# EAGLE board PCB - alu40 - mupusb (EAGLE 9.6.2)
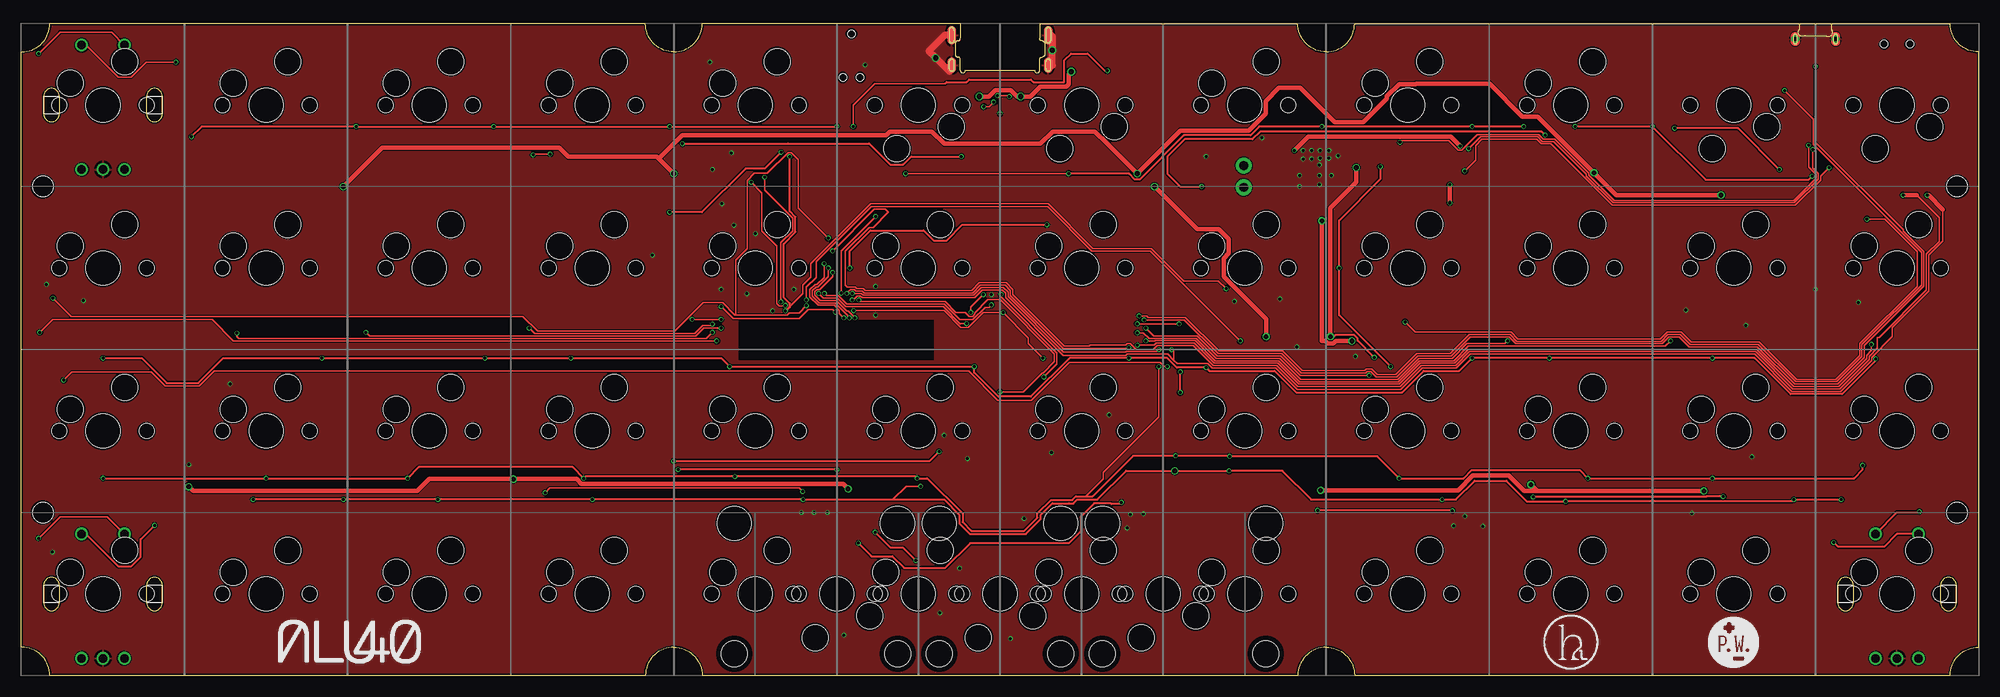
[diagram p2: board, top side]
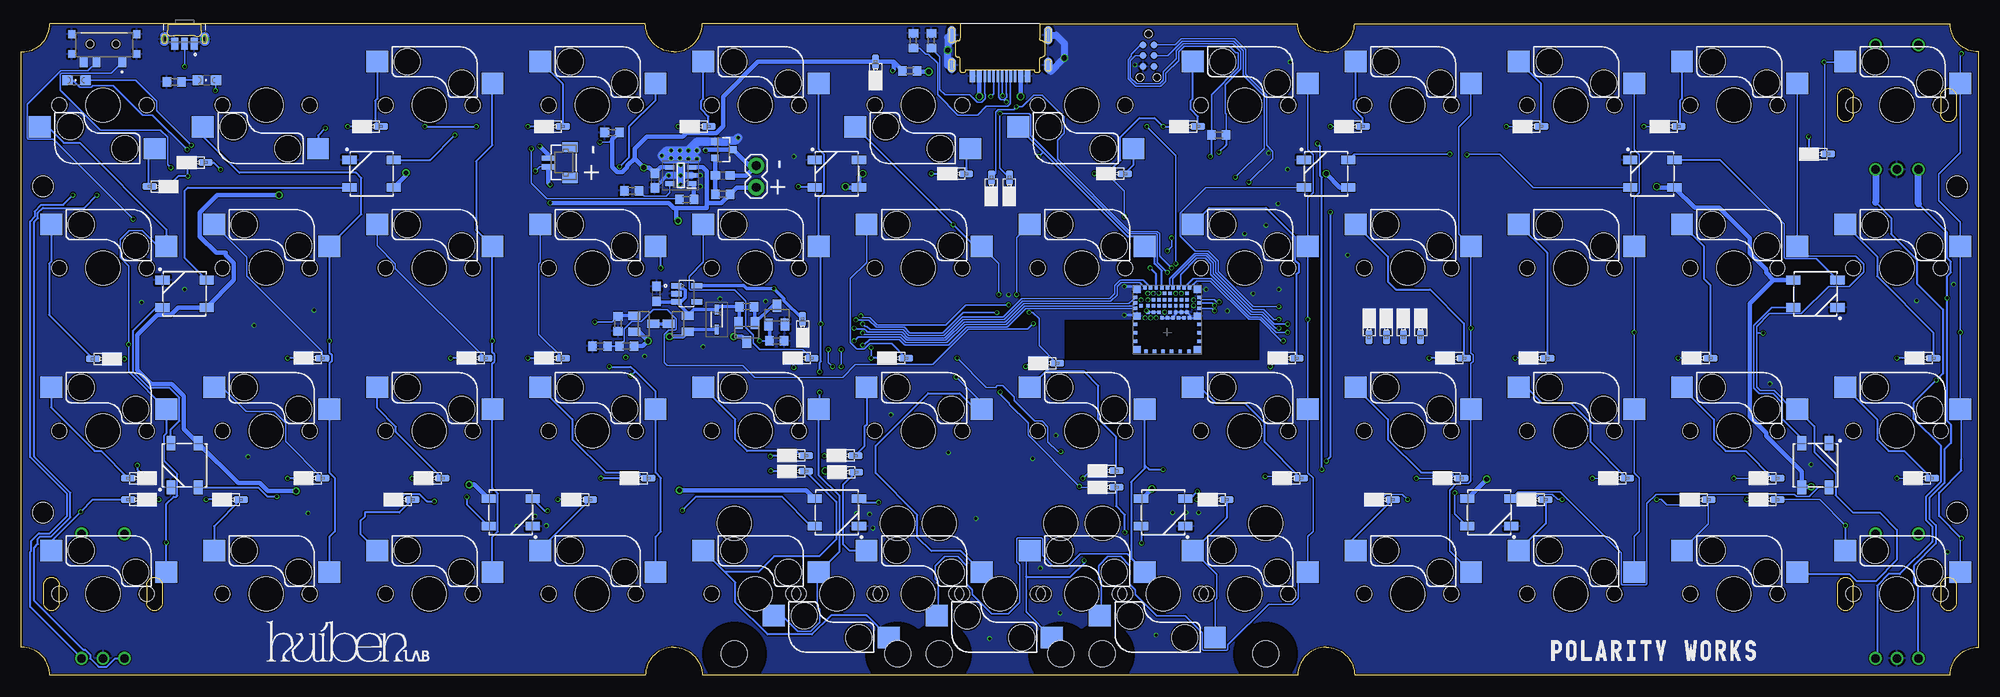
[diagram p3: board, bottom side, seen from below]

Size 228 x 76 mm. Coordinates in mm from the lower left corner, seen from the top.
Outline: 118.62,76 148.7,76 arc90 152,72.7 arc90 155.3,76 224.7,76 arc90 228,72.7 228,3.3 arc90 224.7,0 155.3,0 arc90 152,3.3 arc90 148.7,0 79.3,0 arc90 76,3.3 arc90 72.7,0 4,0 3.3,0 arc90 0,3.3 0,4 0,72.7 arc90 3.3,76 72.7,76 arc90 76,72.7 arc90 79.3,76 109.38,76
Copper layers (1*16): Top 0.035559375mm / dielectric 1.6mm / Bottom 0.035559375mm
Design rules "jlcpcb2layer": minimum track width 5mil, minimum drill 12mil, track to track 5mil, track to pad 5mil, pad to pad 5mil, via to via 5mil, smd to smd 5mil, copper to edge 8mil, drill to drill 6mil, minimum pad ring 5mil, minimum via ring 3mil, stop-mask expansion 2.5mil, vias tented up to drill 0mil, thermal gap 10mil
Holes 2.4 mm at 225.5,19 225.5,57 2.5,19 2.5,57
tRestrict: area 83.6,36.8 to 106.3,41.5
bRestrict: area 83.8,36.8 to 106.5,41.5

## Footprints (pad centres in the part's own frame; a part is rotated, then mirrored left to right if it is on the bottom)
CHERRY = smd 2.55 x 2.5 bottom: 1 6.05,5.08; 2 -7.37,2.54 | hole 3.988: 0,0 | hole 1.753: 5.08,0; -5.08,0 | hole 3.048: -3.81,2.54; 2.54,5.08
ENCODER = drill 0.991: A -2.5,-7.5; B 2.5,-7.5; GND 0,-7.5; S1 -2.5,7; S2 2.5,7
C0603 = smd 1.1 x 1: 1 -0.85,0; 2 0.85,0
SOD-323 = smd 1.676 x 0.813: A 1.04,0; C -1.04,0
SOD2713X115N = smd 1.125 x 0.5: 1 -1.162,0; 2 1.162,0
WS2812B = smd 1.651 x 1: 1 2.577,-1.6; 2 2.577,1.6; 3 -2.577,1.6; 4 -2.577,-1.6
R0603 = smd 1 x 1.1: 1 -0.85,0; 2 0.85,0
SOT23-3 = smd 0.8 x 0.9: 1 -0.95,-1; 2 0.95,-1; 3 0,1.1
SOT95P280X100-5N = smd 1.05 x 0.55: 1 -1.3,0.95; 2 -1.3,0; 3 -1.3,-0.95; 4 1.3,-0.95; 5 1.3,0.95
SK3296S01L1 = smd 0.9 x 1.2: 1 2.25,-2.1; 2 -0.75,-2.1; 3 -2.25,-2.1 | smd 0.8 x 0.9: MP1 -3.65,-1.15; MP2 3.95,-1.15; MP3 3.95,1.15; MP4 -3.65,1.15 | hole 0.9: -1.5,0; 1.5,0
TC2030-MCP-NL = smd 0.787 x 0.787: 1 1.27,-0.635; 2 1.27,0.635; 3 2.54,-0.635; 4 2.54,0.635; 5 3.81,-0.635; 6 3.81,0.635 | hole 0.889: 0,0; 5.08,-1.016; 5.08,1.016
MUP-MIDMNT-SS = smd 0.3 x 1.4: A5 -1.25,4.8; A6 -0.25,4.8; A7 0.25,4.8; A8 1.25,4.8; B5 1.75,4.8; B6 0.75,4.8; B7 -0.75,4.8; B8 -1.75,4.8 | smd 0.6 x 1.4: GND -3.2,4.8; GND2 3.2,4.8; VBUS -2.4,4.8; VBUS2 2.4,4.8 | smd 1 x 1.8: SHLD1 -5.62,3.5; SHLD4 5.62,3.5 | smd 1 x 1.8 bottom: SHLD2 -5.62,3.5; SHLD3 5.62,3.5 | smd 1 x 2.2: SHLD5 -5.62,0; SHLD8 5.62,0 | smd 1 x 2.2 bottom: SHLD6 -5.62,0; SHLD7 5.62,0
1X02 = drill 1.016 pad 1.88: 1 0,0; 2 2.54,0
CHIPLED_0805 = smd 1.2 x 1.2: A 0,-1.05; C 0,1.05
SOT23 = smd 1 x 1.4: 1 -0.95,-1.1; 2 0.95,-1.1; 3 0,1.1
SW_PTS847MM160LSMTR2_LFS = smd 0.8 x 1.4: 1 -1.15,0.55; 2 0,0.55; 3 1.15,0.55 | drill 0.5 pad 0.9: S1 -2.35,0; S2 2.35,0
ISP1807-LR = smd 0.8 x 0.8: 1 0.5,-0.5; 7 0.5,-3.6; 25 7.5,-3.6; 31 7.5,-0.5; 68 0.5,-7.5; 75 7.5,-7.5 | smd 0.4 x 0.4: 2 0.3,-1.4; 3 0.95,-1.725; 4 0.3,-2.05; 5 0.95,-2.375; 6 0.3,-2.7; 8 1.4,-3.8; 9 1.725,-3.15; 10 2.05,-3.8; 11 2.375,-3.15; 12 2.7,-3.8; 13 3.025,-3.15; 14 3.35,-3.8; 15 3.675,-3.15; 16 4,-3.8; 17 4.325,-3.15; 18 4.65,-3.8; 19 4.975,-3.15; 20 5.3,-3.8; 21 5.625,-3.15; 22 5.95,-3.8; 23 6.275,-3.15; 24 6.6,-3.8; 26 7.7,-2.7; 27 7.05,-2.375; 28 7.7,-2.05; 29 7.05,-1.725; 30 7.7,-1.4; 32 6.6,-0.3; 33 6.275,-0.95; 34 5.95,-0.3; 35 5.625,-0.95; 36 5.3,-0.3; 37 4.975,-0.95; 38 4.65,-0.3; 39 4.325,-0.95; 40 4,-0.3; 41 3.675,-0.95; 42 3.35,-0.3; 43 3.025,-0.95; 44 2.7,-0.3; 45 2.375,-0.95; 46 2.05,-0.3; 47 1.725,-0.95; 48 1.4,-0.3; 49 6.275,-1.725; 50 5.625,-1.725; 51 4.975,-1.725; 52 4.325,-1.725; 53 3.675,-1.725; 54 3.025,-1.725; 55 2.375,-1.725; 56 1.725,-1.725; 57 6.275,-2.375; 58 5.625,-2.375; 59 4.975,-2.375; 60 4.325,-2.375; 61 3.675,-2.375; 62 3.025,-2.375; 63 2.375,-2.375; 64 1.725,-2.375; 65 0.3,-4.55; 66 0.3,-5.55; 67 0.3,-6.55; 69 1.5,-7.7; 70 2.5,-7.7; 71 3.5,-7.7; 72 4.5,-7.7; 73 5.5,-7.7; 74 6.5,-7.7; 76 7.7,-6.55; 77 7.7,-5.55; 78 7.7,-4.55
STAB-2U = hole 3.988: -11.938,-8.255; 11.938,-8.255 | hole 3.048: -11.938,6.985; 11.938,6.985
SOT95P285X140-5N = smd 1.35 x 0.6: 1 -1.185,0.95; 2 -1.185,0; 3 -1.185,-0.95; 4 1.185,-0.95; 5 1.185,0.95
BM02B-SRSS-TB = smd 0.6 x 1.55: 1 0.5,0; 2 -0.5,0 | smd 1.2 x 1.8: M1 1.8,-2.525; M2 -1.8,-2.525

## Placement (x,y rotation side)
11  [CHERRY]  9.5,66.5 0 top
11ENC  ENCODERHOLE  [ENCODER]  9.5,66.5 0 top
12  [CHERRY]  28.5,66.5 0 top
13  [CHERRY]  47.5,66.5 0 top
14  [CHERRY]  66.5,66.5 0 top
15  [CHERRY]  85.5,66.5 0 top
16  [CHERRY]  104.5,66.5 180 top
17  [CHERRY]  123.5,66.5 180 top
18  [CHERRY]  142.5,66.5 0 top
19  [CHERRY]  161.5,66.5 0 top
21  [CHERRY]  9.5,47.5 0 top
22  [CHERRY]  28.5,47.5 0 top
23  [CHERRY]  47.5,47.5 0 top
24  [CHERRY]  66.5,47.5 0 top
25  [CHERRY]  85.5,47.5 0 top
26  [CHERRY]  104.5,47.5 0 top
27  [CHERRY]  123.5,47.5 0 top
28  [CHERRY]  142.5,47.5 0 top
29  [CHERRY]  161.5,47.5 0 top
31  [CHERRY]  9.5,28.5 0 top
32  [CHERRY]  28.5,28.5 0 top
33  [CHERRY]  47.5,28.5 0 top
34  [CHERRY]  66.5,28.5 0 top
35  [CHERRY]  85.5,28.5 0 top
36  [CHERRY]  104.5,28.5 0 top
37  [CHERRY]  123.5,28.5 0 top
38  [CHERRY]  142.5,28.5 0 top
39  [CHERRY]  161.5,28.5 0 top
41  [CHERRY]  9.5,9.5 0 top
41ENC\  ENCODERHOLE  [ENCODER]  9.5,9.5 0 top
42  [CHERRY]  28.5,9.5 0 top
43  [CHERRY]  47.5,9.5 0 top
44  [CHERRY]  66.5,9.5 0 top
45  [CHERRY]  85.5,9.5 0 top
45-2  [CHERRY]  95,9.5 180 top
46  [CHERRY]  104.5,9.5 0 top
46-2  [CHERRY]  114,9.5 180 top
47  [CHERRY]  123.5,9.5 0 top
48  [CHERRY]  142.5,9.5 0 top
48-2  [CHERRY]  133,9.5 180 top
49  [CHERRY]  161.5,9.5 0 top
110  [CHERRY]  180.5,66.5 0 top
111  [CHERRY]  199.5,66.5 180 top
112  [CHERRY]  218.5,66.5 180 top
210  [CHERRY]  180.5,47.5 0 top
211  [CHERRY]  199.5,47.5 0 top
212  [CHERRY]  218.5,47.5 0 top
310  [CHERRY]  180.5,28.5 0 top
311  [CHERRY]  199.5,28.5 0 top
312  [CHERRY]  218.5,28.5 0 top
410  [CHERRY]  180.5,9.5 0 top
411  [CHERRY]  199.5,9.5 0 top
412  [CHERRY]  218.5,9.5 0 top
412ENC  ENCODERHOLE  [ENCODER]  218.5,9.5 0 top
C4  10u  [C0603]  154.2,57.7 270 bottom
C5  100n  [C0603]  146.3,58.3 0 bottom
C6  4.7u  [C0603]  154,44.5 90 bottom
D1  1N4148WS  [SOD-323]  18.6,60.8 0 bottom
D2  1N4148WS  [SOD-323]  36,64 0 bottom
D3  1N4148WS  [SOD-323]  52,64 0 bottom
D4  1N4148WS  [SOD-323]  72.8,64 0 bottom
D5  1N4148WS  [SOD-323]  92,64 0 bottom
D6  1N4148WS  [SOD-323]  100.5,58.5 0 bottom
D7  1N4148WS  [SOD-323]  119,58.5 0 bottom
D8  1N4148WS  [SOD-323]  149,64 0 bottom
D9  1N4148WS  [SOD-323]  166,64 0 bottom
D10  1N4148WS  [SOD-323]  187.2,64 0 bottom
D11  1N4148WS  [SOD-323]  207.6,59.8 0 bottom
D12  1N4148WS  [SOD-323]  212,57 180 bottom
D13  1N4148WS  [SOD-323]  6.3,37 0 bottom
D14  1N4148WS  [SOD-323]  32.3,37 0 bottom
D15  1N4148WS  [SOD-323]  51.3,37 0 bottom
D16  1N4148WS  [SOD-323]  61,37 0 bottom
D17  1N4148WS  [SOD-323]  80.5,37 0 bottom
D18  1N4148WS  [SOD-323]  108.4,36.4 0 bottom
D19  1N4148WS  [SOD-323]  126,37 0 bottom
D20  1N4148WS  [SOD-323]  137,37 0 bottom
D21  1N4148WS  [SOD-323]  166,37 0 bottom
D22  1N4148WS  [SOD-323]  175,37 0 bottom
D23  1N4148WS  [SOD-323]  194,37 0 bottom
D24  1N4148WS  [SOD-323]  218.6,36.9 180 bottom
D25  1N4148WS  [SOD-323]  6.5,23 0 bottom
D26  1N4148WS  [SOD-323]  24.5,23 0 bottom
D27  1N4148WS  [SOD-323]  42,23 0 bottom
D28  1N4148WS  [SOD-323]  61.3,23 0 bottom
D29  1N4148WS  [SOD-323]  80,23 0 bottom
D30  1N4148WS  [SOD-323]  101.5,23.85 0 bottom
D31  1N4148WS  [SOD-323]  131.9,25.65 0 bottom
D32  1N4148WS  [SOD-323]  137.65,25.65 0 bottom
D33  1N4148WS  [SOD-323]  156,23 0 bottom
D34  1N4148WS  [SOD-323]  180,23 0 bottom
D35  1N4148WS  [SOD-323]  194,23 0 bottom
D36  1N4148WS  [SOD-323]  214.5,23 180 bottom
D37  1N4148WS  [SOD-323]  24.5,20.5 0 bottom
D38  1N4148WS  [SOD-323]  32.5,20.5 0 bottom
D39  1N4148WS  [SOD-323]  51.5,20.5 0 bottom
D40  1N4148WS  [SOD-323]  69.3,20.5 0 bottom
D41  1N4148WS  [SOD-323]  88.65,20.5 0 bottom
D42  1N4148WS  [SOD-323]  101.5,21.95 0 bottom
D43  1N4148WS  [SOD-323]  137.65,23.8 0 bottom
D44  1N4148WS  [SOD-323]  162.8,20.5 0 bottom
D45  1N4148WS  [SOD-323]  183.5,20.5 0 bottom
D46  1N4148WS  [SOD-323]  203.5,20.5 0 bottom
D47  1N4148WS  [SOD-323]  214.5,20.5 180 bottom
D48  1N4148WS  [SOD-323]  131.85,23.7 0 bottom
D49  1N4148WS  [SOD-323]  65,40.5 270 bottom
D50  1N4148WS  [SOD-323]  67,40.5 270 bottom
D51  1N4148WS  [SOD-323]  69,40.5 270 bottom
D52  1N4148WS  [SOD-323]  71,40.5 270 bottom
D63  SD103AWS-E3-08  [SOD2713X115N]  147,41.5 270 bottom
D64  ESDSOD323  [SOD-323]  112.9,57 90 bottom
D65  ESDSOD323  [SOD-323]  115,57 90 bottom
D66  ESDSOD323  [SOD-323]  137,40.5 90 bottom
D67  ESDSOD323  [SOD-323]  128.5,70.5 90 bottom
D77  WS2812B  [WS2812B]  76,58.5 0 bottom
D78  WS2812B  [WS2812B]  38,58.5 0 bottom
D79  WS2812B  [WS2812B]  19,44.5 180 bottom
D80  WS2812B  [WS2812B]  19,24.5 270 bottom
D81  WS2812B  [WS2812B]  57,19 180 bottom
D82  WS2812B  [WS2812B]  95,19 180 bottom
D83  WS2812B  [WS2812B]  133,19 180 bottom
D84  WS2812B  [WS2812B]  171,19 180 bottom
D85  WS2812B  [WS2812B]  209,24.5 90 bottom
D86  WS2812B  [WS2812B]  209,44.5 0 bottom
D87  WS2812B  [WS2812B]  187.2,58.5 0 bottom
D88  WS2812B  [WS2812B]  133,58.5 0 bottom
FUSE  500m  [R0603]  124.5,70.5 180 bottom
IC1  XB3303ASOT23  [SOT23-3]  146.2,61.3 270 bottom
IC2  TP4054-42-SOT25-R  [SOT95P280X100-5N]  151.2,58.3 180 bottom
J1  SK-3296S-01-L1  [SK3296S01L1]  218.5,73.6 0 bottom
J2  [TC2030-MCP-NL]  96.7,74.8 270 bottom
J3  [MUP-MIDMNT-SS]  114,74.65 180 bottom
J4  [1X02]  142.4,56.9 90 bottom
LED1  RED  [CHIPLED_0805]  206.4,69.4 90 bottom
LED2  [CHIPLED_0805]  221.6,69.4 90 bottom
Q2  PMOSFET  [SOT23]  155.5,41 270 bottom
Q3  PMOSFET  [SOT23]  143.5,40 180 bottom
Q5  PMOSFET  [SOT23]  151.5,41 90 bottom
Q6  NMOSFET  [SOT23]  140,42 0 bottom
R1  200  [R0603]  210.2,69.2 0 bottom
R2  100k  [R0603]  88.5,63 0 bottom
R4  100k  [R0603]  158.5,41 90 bottom
R5  100k  [R0603]  143.5,43 0 bottom
R6  100k  [R0603]  140,39 0 bottom
R11  5.1k  [R0603]  122,74 270 bottom
R12  5.1k  [R0603]  124.1,74 270 bottom
R13  2k  [R0603]  156.9,56.5 0 bottom
R14  1.2k  [R0603]  150.5,55.5 0 bottom
R15  100  [R0603]  146.3,56.1 0 bottom
R17  100k  [R0603]  159.2,63.3 0 bottom
R19  100K  [R0603]  157.5,38.4 180 bottom
R20  100k  [R0603]  160.6,38.4 180 bottom
S1  PTS847MM160LSMTR2_LFS  [SW_PTS847MM160LSMTR2_LFS]  209,74.2 180 bottom
U1  ISP1807-LRISP1807-LR_ISP1807-LR  [ISP1807-LR]  98.5,45.5 0 bottom
U$8  STAB-2U  [STAB-2U]  95,9.5 180 top
U$9  STAB-2U  [STAB-2U]  114,9.5 180 top
U$10  STAB-2U  [STAB-2U]  133,9.5 180 top
VREG  AP2112K-3.3TRG1  [SOT95P285X140-5N]  150.5,44.5 0 bottom
X1  BM02B-SRSS-TB  [BM02B-SRSS-TB]  166.6,59.8 90 bottom

## Tracks (layer width: path | path; a pad name or v marks a point on that pad's centre or on a via)
A  (via drill 0.35)
  Top 0.152: U1.27 90.61,42.28 89.44,42.28 89.19,42.03 83.12,42.03 | 83.12,42.03 81.69,43.47 79.44,43.47 76.11,40.14 60.15,40.14 58.42,41.87 5.79,41.87 v3.66,44 | v94.5,49.5 99.36,54.36 100.64,54.36 101,54 99.22,52.22 98.76,52.22 96,49.47 96,45.5 96.2,45.3 97.11,45.3 97.3,45.11 98.06,45.11 98.28,44.89 110.7,44.89 111.61,45.8 114.7,45.8 115.49,45.01 115.49,44.39 121.46,38.42 124.42,38.42 124.5,38.5 128.63,38.5 128.81,38.68 129.19,38.68 129.84,38.02 131.87,38.02 132.31,38.47 136.49,38.47 138.83,36.13 146.24,36.13 148.68,33.68 160.66,33.68 163.1,36.13 167.07,36.13 168.69,37.74 202.02,37.74 206.35,33.41 211.85,33.41 215.25,36.82 215.25,37.21 216.23,38.18 216.23,39.4 216.41,39.4 221.92,44.92 221.92,49.1 223.4,50.59 223.4,53.4 220.8,56 | 83.12,42.03 83.23,42.14 83.23,48.44 84.53,49.75 84.53,57.69 85.39,58.55 86.89,58.55 89.31,60.97 89.69,60.97 90.5,60.16 90.5,54.5 v94,51
  Top 0.508: v219.2,56 220.8,56
  Bottom 0.152: v94.5,49.5 94,50 v94,51
  Bottom 0.254: 41ENC\.A 7,10.31 7.54,10.85 7.54,12.81 4.96,15.39 4.96,17.5 5.72,18.26 5.72,20.72 3.99,22.45 3.99,26.33 3.21,27.1 3.21,29.24 3.66,29.68 v3.66,44 3.66,46.55 3.21,47 3.21,48.24 3.66,48.69 3.66,51.66 7,55 | 412ENC.A 217.09,2 218.09,1 219,1 220,2 220,2.41 220.59,3 220.79,3 226.5,8.7 226.5,14.9 226.08,15.32 226.08,15.94 225.81,16.2 224.54,16.2 222.3,18.44 222.3,21.3 226.5,25.5 226.5,52.9 226.08,53.32 226.08,53.94 225.51,54.5 220.7,54.5 v219.2,56 | U1.27
  Bottom 0.813: 7,55 11ENC.A
  other vias: 91.45,43.12
B  (via drill 0.35)
  Top 0.152: U1.56 96.89,43.77 97.36,44.24 97.74,44.24 97.93,44.05 111.05,44.05 111.95,44.96 114.28,44.96 114.66,44.59 114.66,44.05 121.37,37.33 128.67,37.33 128.81,37.47 133.53,37.47 134.25,36.75 | 134.25,36.75 134.63,36.37 138.19,36.37 138.73,35.83 146.14,35.83 148.64,33.33 160.7,33.33 163.2,35.83 167.17,35.83 168.81,37.47 201.9,37.47 206.24,33.13 211.96,33.13 215.53,36.7 215.53,37.09 217.95,39.51 217.95,40.55 222.2,44.8 222.2,48.99 223.84,50.63 223.84,54.33 | 134.25,36.75 134.25,37.75 v134,38 | v133.5,36 133.16,36 132.69,36.47 125.03,36.47 125,36.5 122.07,36.5 117.64,32.07 113.76,32.07 110.33,35.5 22.47,35.5 20.74,33.77 16.76,33.77 15.15,35.38 5.88,35.38 v4.93,34.43
  Top 0.508: v222,56 222.17,56 223.84,54.33
  Bottom 0.152: v134,38 134,36.5 v133.5,36
  Bottom 0.254: 12,55.16 10.19,53.35 10.19,51.47 7.18,48.46 7.18,45.68 4.17,42.67 4.17,35.18 v4.93,34.43 7.54,31.81 7.54,29.92 4.37,26.74 4.37,22.61 6.1,20.88 6.1,18.1 5.4,17.4 5.4,15.59 9.17,11.82 10.46,11.82 11.82,10.46 11.82,2.18 41ENC\.B | 412ENC.B 227,8 227,14.4 226.88,14.52 226.88,15.67 225.97,16.58 224.7,16.58 222.68,18.6 222.68,21.14 227,25.46 227,52.94 226.46,53.48 226.46,54.09 225.67,54.88 223.12,54.88 v222,56
  Bottom 0.813: 11ENC.B 12,55.16
  other vias: 96.78,43.77
BLED  (via drill 0.35)
  Top 0.152: U1.37 93.79,44.28 95.13,44.28 96.13,43.28 107.51,43.28 109.29,41.5 110.84,41.5 112.26,42.92 112.72,42.92 v112.99,43.19 | v130.2,41.93 131.07,41.93 131.25,41.74 135.58,41.74 139.52,37.8 146.93,37.8 149.19,35.54 156.5,35.54 156.69,35.73 157.31,35.73 157.96,35.08 160.08,35.08 162.52,37.52 166.43,37.52 168.66,39.74 173.44,39.74 174.22,38.96 191.03,38.96 191.82,39.74 193.25,39.74 194.42,38.58 202.36,38.58 206.7,34.25 211.5,34.25 214.42,37.16 214.42,38.56 215.12,39.26 221.36,45.51 221.36,49.31 208.72,61.95 208.72,64.88 v205.4,68.2
  Bottom 0.152: U1.37 | v112.99,43.19 118.01,43.19 120.32,40.88 128.28,40.88 129.15,41.74 130.01,41.74 v130.2,41.93 | v205.4,68.2 205.35,68.25 LED1.A
  other vias: 93.53,44.55
BVOLT  (via drill 0.35)
  Top 0.152: U1.35 93.06,44.36 93.41,44 95.01,44 96.03,42.99 107.41,42.99 109.4,41 109.42,41.02 v110.12,41.02
  Bottom 0.152: R19.2 157.75,39 157.75,40.4 156.9,41.25 155.82,41.25 154.41,42.65 152.77,42.65 151.7,41.58 151.7,40.42 151.82,40.3 152.57,40.3 153.12,39.76 153.12,36.47 152.79,36.15 143.98,36.15 142.59,34.76 132.33,34.76 130.85,36.24 121.81,36.24 117.69,40.37 110.78,40.37 v110.12,41.02
  Bottom 0.254: R20.1 R19.2
  other vias: 92.88,44.55
COL0  (via drill 0.35)
  Top 0.152: v81,39 24.7,39 22.2,41.5 3.63,41.5 v2.13,40
  Top 0.203: 41ENC\.S2 10,18.5 4.5,18.5 v2,16 | 11ENC.S2 10.5,75 4.5,75 v2,72.5
  Bottom 0.152: U1.32 91.1,46 89.5,46 85.03,41.53 83.74,41.53 81.21,39 v81,39
  Bottom 0.203: v2,16 2.13,15.87 41.2 | 2,25.2 2,30.91 31.2 v2.13,40 21.2 2.13,52.84 4.63,55.34 4.63,58.44 2.13,60.94 11.2 2.13,72.37 v2,72.5
  Bottom 0.254: v2,16 4.6,18.6 4.6,21.3 2,23.9 2,25.2
COL1  (via drill 0.35)
  Top 0.152: v80.5,40 79.8,39.3 25.3,39.3 25.1,39.49 v25.1,39.9
  Bottom 0.152: U1.34 92.3,45.45 92.3,45.48 91.51,46.28 89.38,46.28 84.92,41.81 83.63,41.81 81.82,40 v80.5,40 | v25.1,39.9 25.86,39.9
  Bottom 0.203: 12.2 22.2 19.98,48.89 14.3,48.89 13.4,47.99 13.4,47.01 15.04,45.37 17.46,45.37 20.66,42.17 24.36,42.17 25.86,40.67 25.86,39.9 25.86,33.64 25.42,33.2 23.8,33.2 21.64,31.04 32.2
  Bottom 0.254: 32.2 19.13,29.04 19.13,26.04 16.65,23.56 16.65,21 14.65,19 11.5,19 9.5,17 9.5,13.5 12,11 14.2,11 14.98,11.78 20.87,11.78 42.2
COL2  (via drill 0.35)
  Top 0.152: v81.5,40.5 79.5,40.5 78.58,39.58 40.55,39.58 v40.13,40
  Bottom 0.152: U1.36 92.95,45.45 92.95,46.76 91.06,48.66 90.1,48.66 89.42,47.98 89.42,46.72 84.8,42.09 83.51,42.09 81.92,40.5 v81.5,40.5
  Bottom 0.203: 13.2 40.13,61.3 39.52,60.7 39.52,56.3 40.13,55.7 23.2 v40.13,40 33.2 40.13,23.62 39.52,23.01 39.52,16.8 40.13,16.2 43.2
COL3  (via drill 0.35)
  Top 0.152: v80.5,40.97 80.31,40.78 79.38,40.78 78.46,39.86 59.77,39.86 v59.13,40.5
  Bottom 0.152: U1.38 93.85,46.26 91.17,48.94 89.99,48.94 89.14,48.09 89.14,46.83 84.68,42.37 83.39,42.37 82.03,41 80.53,41 v80.5,40.97
  Bottom 0.2: 61.63,20 61.63,21.57 60.83,22.37 59.45,22.37 59.13,22.68 59.13,23.2
  Bottom 0.203: 44.2 61.63,14.54 61.63,20 | 59.13,23.2 34.2 59.13,36.38 58.89,36.62 58.89,37.38 59.13,37.62 v59.13,40.5 24.2 60.53,51.44 60.53,63.94 59.13,65.34 14.2
COL4  (via drill 0.35)
  Top 0.152: v81.5,41.5 v78.13,41.5
  Bottom 0.152: U1.40 94.25,45.45 94.25,46.25 91.29,49.22 89.87,49.22 88.86,48.21 88.86,46.95 84.57,42.65 83.28,42.65 82.13,41.5 v81.5,41.5
  Bottom 0.203: 15.2 78.13,61.3 77.52,60.7 77.52,56.3 78.13,55.7 25.2 v78.13,41.5 35.2 78.13,23.62 77.52,23.01 77.52,16.8 78.13,16.2 45.2 79.24,10.93 79.24,9.01 79.93,8.32 82.7,8.32 87.45,3.57 87.45,3.08 87.58,2.94 90.32,2.94 90.45,3.08 90.45,5 92.41,6.96 95.71,6.96 98.24,9.49 98.24,9.99 98.86,10.61 98.86,12.8 99.93,13.87 101.45,13.87 102.52,12.8 102.52,11.28 102.2,10.96 102.2,7.13 45-2.2
COL5  (via drill 0.35)
  Top 0.254: v95,24 v76.5,24 | v77,62 89.27,62 89.29,62.02 98.74,62.02 101.19,59.57 102.73,59.57 103.66,60.5 v109.5,60.5
  Bottom 0.203: 46.2 97.13,12.13 99.2,14.2 104.65,14.2 106.1,12.75 107.8,12.75 109.05,14 109.05,15.93 109.18,16.06 111.92,16.06 112.05,15.93 112.05,13.23 111.7,12.88 111.7,8.55 113.05,7.2 114.95,7.2 117.24,9.49 117.24,9.99 117.86,10.61 117.86,12.8 118.93,13.87 120.45,13.87 121.52,12.8 121.52,11.28 121.2,10.96 121.2,7.13 46-2.2
  Bottom 0.254: 46.2 98.73,13.64 98.73,22.56 97.13,24.16 97.13,24.5 | 97.13,24.5 36.2 | U1.42 95.15,47.18 95.98,48.02 95.98,48.89 26.2 98.25,51.16 99.11,51.16 108.97,61.03 | 97.13,24.5 96.63,24 v95,24 | v76.5,24 76.5,58.06 76.67,58.22 76.67,61.67 v77,62 | 108.97,61.03 110.72,62.78 110.72,62.81 16.2 | v109.5,60.5 108.97,61.03
COL6  (via drill 0.35)
  Top 0.152: v114.12,44.42 114.12,44.12 120.62,37.62 120.62,36.33 v119.1,34.8
  Top 0.254: v96.5,47.5 96.5,49.5 98.89,51.89 105.1,51.89 106.27,50.73 107.81,50.73 109.63,52.55 v119.45,52.55
  Bottom 0.152: 37.2 116.13,31.83 v119.1,34.8 | v114.12,44.42 114.12,48.03 27.2
  Bottom 0.254: 17.2 v119.45,52.55 116.95,50.04 27.2 | 47.2 118.59,14.5 122,14.5 123.61,16.11 123.61,18.72 128.5,23.6 128.5,26.79 122.39,32.9 118.7,32.9 116.84,31.04 37.2 | U1.44 95.8,46.8 v96.5,47.5
COL7  (via drill 0.35)
  Top 0.152: v130,41 v134.87,41
  Top 0.254: v135,33 v135,35.38
  Bottom 0.152: U1.46 96.7,45.45 96.7,45.48 97.32,46.1 100.01,46.1 100.64,45.47 100.64,44.5 101.23,43.92 111.46,43.92 113.62,41.76 118.42,41.76 120.54,39.64 124.61,39.64 125.28,40.32 129.13,40.32 129.5,40.69 129.69,40.69 v130,41
  Bottom 0.203: 48.2 135.3,11.87 135.3,8.04 134.98,7.72 134.98,6.2 136.05,5.13 137.57,5.13 139.4,6.96 48-2.2
  Bottom 0.254: 18.2 135.13,61.34 134.5,60.7 134.5,56.3 135.13,55.66 28.2 134.87,49.78 v134.87,41 134.87,36.61 135,36.48 v135,35.38 | v135,33 135,31.17 38.2 135.13,23.35 132.69,20.91 132.69,14.48 48.2
COL8  (via drill 0.35)
  Top 0.152: v157,34.98 148.96,34.98 146.7,37.24 139.29,37.24 136.95,39.58 131.92,39.58 v131,40.5
  Top 0.254: v159.5,36 153.5,42 v153.5,47.5 153.5,53.06 158.32,57.88 158.32,59.28 v158.3,59.3
  Bottom 0.152: U1.48 97.11,45.2 97.74,45.82 99.89,45.82 100.37,45.35 100.37,44.37 101.1,43.64 111.35,43.64 113.5,41.48 118.3,41.48 120.42,39.37 124.73,39.37 125.4,40.04 129.5,40.04 129.53,40.07 129.53,40.14 129.81,40.41 130.91,40.41 v131,40.5 | v157,34.98 156.52,35.47 156.52,35.48
  Bottom 0.254: 49.2 154.13,16.16 153.5,16.8 153.5,23.02 154.13,23.66 39.2 154.13,33.09 156.52,35.48 157.02,35.98 159.48,35.98 v159.5,36 | v153.5,47.5 153.5,49.41 29.2 | v158.3,59.3 157.23,60.37 157.23,63.99 154.13,67.08 19.2
COL9  (via drill 0.35)
  Top 0.152: v130,39.95 130.71,39.95 131.38,39.28 131.94,39.28 131.96,39.3 136.84,39.3 139.17,36.97 146.58,36.97 149.03,34.52 160.31,34.52 162.75,36.97 166.66,36.97 168.4,38.7 172.83,38.7 v173.13,39
  Bottom 0.152: U1.2 98.45,43.85 98.48,43.85 98.98,43.36 111.23,43.36 113.39,41.2 118.19,41.2 120.31,39.09 124.84,39.09 125.52,39.76 129.81,39.76 v130,39.95
  Bottom 0.254: 110.2 173.13,61.84 175.03,59.94 175.03,51.94 210.2 v173.13,39 173.13,37.66 172.87,37.39 172.87,36.61 173.13,36.34 310.2 173.13,21.84 172.5,21.2 172.5,16.8 173.13,16.16 410.2
COL10  (via drill 0.35)
  Top 0.152: v131,39 132.05,39 132.08,39.02 136.72,39.02 139.06,36.69 146.47,36.69 148.91,34.24 160.43,34.24 162.87,36.69 166.84,36.69 168.56,38.4 191.53,38.4 v192.13,39
  Bottom 0.152: U1.4 98.45,43.2 98.48,43.2 98.61,43.08 111.12,43.08 113.27,40.92 118.07,40.92 120.19,38.81 124.96,38.81 125.63,39.48 130.52,39.48 v131,39
  Bottom 0.203: 111.2 206.87,62.87
  Bottom 0.254: 411.2 192.13,16.16 191.5,16.8 191.5,23.02 192.13,23.66 311.2 192.13,36.34 191.87,36.61 191.87,37.39 192.13,37.66 v192.13,39 211.2 188.4,53.77 188.4,58 189,58.6 202.6,58.6 206.3,62.3 206.87,62.87
COL11  (via drill 0.35)
  Top 0.152: v130.01,38.51 131.96,38.51 132.19,38.74 136.6,38.74 138.94,36.41 146.35,36.41 148.8,33.96 160.54,33.96 162.99,36.41 166.96,36.41 168.58,38.02 202.13,38.02 206.47,33.69 211.73,33.69 214.98,36.93 214.98,37.32 215.51,37.86 v215.51,38.6
  Top 0.254: 412ENC.S2 218.5,16.5 217,15 211.63,15 v211.13,15.5
  Bottom 0.152: v130.01,38.51 129.85,38.51 129.19,39.18 125.72,39.18 125.07,38.53 119.97,38.53 117.86,40.65 113.16,40.65 111,42.8 U1.6
  Bottom 0.2: 212.2 212.11,50.04 213.93,51.87 215.45,51.87 216.52,50.8 216.52,48.77 215.51,47.76 v215.51,38.6 215.51,35.42 312.2
  Bottom 0.254: 212.2 211.13,52 221.24,62.11 223.08,62.11 224.93,63.96 112.2 | 312.2 211.13,28.23 211.35,28.01 211.35,25 209.85,23.49 209.85,20.99 210,20.84 210.29,20.84 211.13,20 v211.13,15.5 412.2
D+  (via drill 0.35)
  Top 0.152: U1.8 96.92,41.89 96.31,42.5 96.12,42.5 94.9,43.73 93.04,43.73 92.41,44.36 92.41,44.74 92.68,45.02 93,45.02 94.5,46.52 v94.5,47 | v115.1,67.5 115,67.6 v113.7,67.6 114,67.3 v114,65.5
  Bottom 0.152: U1.8 | v94.5,47 95.65,48.15 95.65,51.37 95.77,51.49 98.97,51.49 110.39,62.91 110.39,65.29 110.6,65.5 v114,65.5 | J3.A6 113.75,67.65 v113.7,67.6 | v115.1,67.5 114.75,67.85 J3.B6
  Bottom 0.2: v114,65.5 114,59.14 D64.A
  other vias: 97.1,41.7
D-  (via drill 0.35)
  Top 0.152: U1.10 96.27,41.89 96.27,41.96 94.78,43.45 92.93,43.45 92.13,44.24 92.13,44.86 92.57,45.3 92.8,45.3 94,46.5 v94,47.5 | v113.26,66.84 112.73,66.31 v112.1,66.31
  Bottom 0.152: U1.10 | v112.1,66.31 111.41,66.31 110.06,67.66 109.1,67.66 106.51,65.06 106.51,63.21 107.29,62.43 107.29,60.21 98.86,51.77 95.66,51.77 95.37,51.49 95.37,48.87 v94,47.5 | 113.51,67.13 113.23,67.41 113.23,67.79 113.25,67.81 J3.B7 | 113.51,67.13 113.89,67.13 114.17,67.41 114.17,69.02 J3.A7 | 113.51,67.13 113.51,67.09 v113.26,66.84
  Bottom 0.2: D65.A 114.5,58.54 114.5,65.69 114.2,65.99 112.42,65.99 v112.1,66.31
  other vias: 96.45,41.7
G_BAT  (via drill 0.35)
  Top 0.508: v148.3,61.2 149.9,62.8 166.5,62.8 v167.6,61.7
  Bottom 0.508: C5.2 143.54,58.3 J4.2 143.24,59.44 IC1.3 148.4,61.3 v148.3,61.2 | X1.1 166.6,60.7 v167.6,61.7
GND  (via drill 0.35, 0.6)
  Top 0.813: J3.SHLD3 120.1,71.1 v120.1,72.9 120.1,74.47 119.92,74.65 J3.SHLD8 | J3.SHLD5 107.58,74.65 105.72,72.8 106.5,72.02 | 106.5,72.02 v106.5,72 | J3.SHLD1 108.12,70.4 106.5,72.02
  Bottom 0.254: U1.14 U1.16 U1.18 93.65,41.9 93.65,42.01 93.53,42.13 U1.19 U1.21 U1.23 91.9,42.02 U1.24 91.2,41.7 U1.25
  Bottom 0.305: U1.1 98.36,45.36 v99.5,45.36 | U1.7 98.1,42 v99.5,42
  Bottom 0.406: C4.2 153.35,57.7 153.35,57.76 152.82,58.3 v152.6,58.3
  Bottom 0.61: v148.9,58.3 IC2.2
  Bottom 0.8: IC2.2 v151.2,58.3 v152.6,58.3
  Bottom 0.813: J3.SHLD1 108.1,70.4 v106.5,72 106.5,73.7 107.45,74.65 J3.SHLD5 | J3.SHLD8 119.82,74.65 120.1,74.37 v120.1,72.9 120.1,71.1 J3.SHLD3
  Bottom 1.016: v150.3,61.2 149.25,62.25 IC1.1 145.9,62.25 145.81,62.34 144.87,62.34 v144.5,62.7 | v149.3,61.2 152.8,61.2 v153.4,60.6 153,60.2 151.2,60.2 | 151.2,60.2 v149.3,60.2 | 151.2,60.2 v151.2,58.3 v151.2,57.2
  other vias: 87.5,42.5 84.5,44.5 85.5,51.5 81.5,45 83,52.5 73.5,49 80.5,59 138,60.5 214,43.5 209,45 90,45 120,26 107.5,28 110.2,25.3 113,44.4 193.9,42.6 200.9,40.8 201.6,25.5 194.6,18.9 148.6,38.3 146.6,43.9 155.4,37.2 141.3,43.6 126.7,30.4 129.2,18.8 115.2,4.3 107,7.3 109.3,12.5 95.8,4.7 3.6,14.4 24.3,34 19.5,24.6 7.2,43.7 2.9,45.6 81.6,55 82.7,60.9 80.2,71.5 116.8,18.3 151.2,59.5 151.3,60.3 150.3,60.2 151.3,61.2 152.3,61.2 152.3,60.3 98.3,71.2 148.9,57 90.85,19 92.35,19 93.9,19 130.7,18.85 128.8,17.2 166.85,17.45 168.15,18.55 170.25,17.4
  pour Bottom: 0,0 0,76 228,76 228,0
  pour Top: 0,0 0,76 228,76 228,0
N$1
  Bottom 0.254: D48.A 132.31,22.2 132.31,15.34 131.55,14.58 47.1
N$2
  Bottom 0.254: 12.1 34.55,67.24 34.79,67 34.79,64.17 D2.A
N$3
  Bottom 0.254: D3.A 50.96,68.99 13.1
N$4
  Bottom 0.254: D4.A 71.76,64.97 72.79,66 72.79,67 72.55,67.24 14.1
N$5
  Bottom 0.254: D5.A 90.96,65.17 91.79,66 91.79,67 91.55,67.24 15.1
N$6
  Bottom 0.254: 16.1 98.45,59.51 D6.A
N$7
  Bottom 0.254: 17.1 117.96,60.91 D7.A
N$8
  Bottom 0.254: D8.A 147.96,65.17 148.79,66 148.79,67 148.55,67.24 18.1
N$9
  Bottom 0.254: 19.1 164.96,68.99 D9.A
N$10
  Bottom 0.254: 110.1 186.55,67.24 186.79,67 186.79,64.63 D10.A
N$11  (via drill 0.35)
  Top 0.254: v204.8,59 200,63.8 v192.6,63.8
  Bottom 0.254: D11.A 205.6,59.8 v204.8,59 | v192.6,63.8 193.45,62.95 111.1
N$12
  Bottom 0.203: 112.1 213.46,60.41 213.24,60.2
  Bottom 0.254: 213.24,60.2 213.24,57.2 D12.A
N$13
  Bottom 0.254: 21.1 11.82,48.85 11.82,46.54 5.26,39.97 D13.A
N$14
  Bottom 0.254: D14.A 31.26,45.54 32.01,46.29 32.01,50.04 22.1
N$15
  Bottom 0.254: 23.1 50.26,49.29 D15.A
N$16
  Bottom 0.254: 24.1 68.82,48.85 68.82,45.94 67.89,45 63.9,45 59.96,41.06 D16.A
N$17
  Bottom 0.254: 25.1 89.63,54.5 83,54.5 79.66,51.16 79.66,48.45 79.21,48 79.21,47 79.46,46.75 D17.A
N$18  (via drill 0.35)
  Top 0.152: v110.61,42.33 110.61,42.95 v112.05,44.39
  Bottom 0.152: v110.61,42.33 110.17,42.33 109.45,41.61 109.45,38.49 D18.A | v112.05,44.39 112.05,51.08 26.1
N$19
  Bottom 0.152: 27.1 129.55,48.16 131.47,46.25 131.47,38.81 130.71,38.05 129.82,38.05 129.19,38.68 126.64,38.68 D19.A
N$20
  Bottom 0.152: D20.A 136.96,38 142,38
  Bottom 0.203: 142,38 142.77,38.77 142.77,39.7 143.62,40.55 143.62,43.65 144.9,44.92 150.06,44.92 150.22,45.08 150.22,46.53 148.55,48.2 28.1
N$21
  Bottom 0.152: 29.1 167.55,48.16 167.74,47.98 167.74,39.78 D21.A
N$22
  Bottom 0.152: D22.A 184.42,47.46 184.42,47.98 186.55,50.1 210.1
N$23
  Bottom 0.152: 211.1 201.77,48.8 201.77,46.56 192.96,37.74 D23.A
N$24
  Bottom 0.254: 212.1 224.55,48.24 224.79,48 224.79,42.05 D24.A
N$25
  Bottom 0.254: 31.1 11.82,29.85 11.82,27.54 10.46,26.18 8.64,26.18 D25.A
N$26
  Bottom 0.254: D26.A 23.97,23 27.15,26.18 29.46,26.18 30.82,27.54 30.82,29.85 32.1
N$27
  Bottom 0.254: D27.A 45.18,27.22 45.18,29.46 47.44,31.73 50.81,31.73 52.66,33.58 33.1
N$28
  Bottom 0.254: 34.1 68.82,29.85 68.82,27.54 64.95,23.66 61.52,23.66 60.85,23 D28.A
N$29
  Bottom 0.254: D29.A 83.18,27.22 83.18,29.46 85.44,31.73 88.81,31.73 90.66,33.58 35.1
N$30
  Bottom 0.254: 36.1 108.7,35.43 104.2,35.43 102.54,33.78 102.54,29.92 100.46,27.83 D30.A
N$31
  Bottom 0.254: 37.1 129.55,29.24 129.79,29 129.79,26.72 D31.A
N$32
  Bottom 0.254: 38.1 144.82,29.85 144.82,27.54 143.46,26.18 139.65,26.18 139.51,26.31 137.87,26.31 137.21,25.65 D32.A
N$33
  Bottom 0.254: 39.1 163.82,29.85 163.82,27.54 159.95,23.66 156.22,23.66 155.56,23 D33.A
N$34
  Bottom 0.254: D34.A 184.37,28.41 184.37,29 186.55,31.18 310.1
N$35
  Bottom 0.152: 311.1 204.59,33.58 201.78,30.77 198.56,30.77 197.23,29.44 197.23,27.27 D35.A
N$36
  Bottom 0.254: D36.A 218.72,26.18 219.46,26.18 224.55,31.26 312.1
N$37  (via drill 0.35)
  Top 0.2: v61.6,60.8 59.7,60.8 v59.6,60.7
  Bottom 0.2: D77.2 72.72,60.8 v61.6,60.8 | v59.6,60.7 59.5,60.8 55.8,60.8 51.9,56.9 D78.4
N$38
  Bottom 0.152: 42.1 31.46,17.67 D38.A
N$39
  Bottom 0.254: 43.1 50.4,17.73 50.4,20.44 D39.A
N$40
  Bottom 0.254: D40.A 73,15.76 73,14 72.55,14.45 44.1
N$41
  Bottom 0.203: 45-2.1 88.95,8.8 88.74,9.01 88.74,11.77 91.48,14.52 45.1
  Bottom 0.254: D41.A 87.61,18.39 91.48,14.52
N$42
  Bottom 0.254: U1.22 U1.20
N$43
  Bottom 0.254: 48-2.1 129.53,7 133.68,7 135.91,4.78 141.07,4.78 144.82,8.53 144.82,10.85 48.1 146.05,12.08 142.12,12.08 140.3,13.89 135.06,13.89 133.07,15.88 133.07,20.26 D43.A
N$44
  Bottom 0.254: D44.A 167.55,14.71 49.1
N$45
  Bottom 0.254: D45.A 183.96,19 188,19 188,18.51 188.5,18 188.5,16.53 410.1
N$46
  Bottom 0.254: D46.A 205.55,17.41 411.1
N$47  (via drill 0.35)
  Top 0.254: v104.2,13.4 102.71,14.9 101.25,14.9 v99.45,16.7
  Bottom 0.203: 46-2.1 110.95,7.42 110.95,11.5 110.95,14.18 46.1
  Bottom 0.254: 110.95,11.5 105.79,11.5 104.2,13.08 v104.2,13.4 | v99.45,16.7 99.45,18.75 100.46,19.76 D42.A
N$48  (via drill 0.35)
  Top 0.254: 412ENC.S1 218.5,19 221.1,19 v221.1,19.1
  Bottom 0.254: 412.1 224.55,15.65 v221.1,19.1 219.7,20.5 D47.A
N$49  (via drill 0.35)
  Top 0.254: 41ENC\.S1 7.5,16.5 11.27,12.73 12.81,12.73 13.89,13.81 13.89,15.89 v15.5,17.5
  Bottom 0.152: v15.5,17.5 18.5,20.5 D37.A
  Bottom 0.254: v15.5,17.5 15.55,17.45 41.1
N$50
  Bottom 0.254: LED1.C 209.15,69.4 R1.2
N$52
  Bottom 0.508: IC1.2 147.2,58.35 C5.1 R15.1
N$53
  Bottom 0.152: IC2.5 152.5,56.28 152.9,55.88 155.43,55.88 R13.2
N$54
  Bottom 0.152: J3.A5 112.8,69.05 112.8,66.65 113.08,66.37 115.57,66.37 116.6,65.34 118.9,65.34 121.28,67.72 121.28,71.38 122.35,72.45 122.63,72.45 123.34,73.15 R12.2
N$55
  Bottom 0.152: J3.B5 115.75,67.77 115.75,67.23 116.13,66.85 116.67,66.85 117.52,67.7 120.4,67.7 121,68.3 121,72.15 R11.2
N$59
  Bottom 0.508: IC2.1 149.65,57.34 R14.2
N$60  (via drill 0.35)
  Top 0.152: v168.61,61.39 170.01,62.79 176.66,62.79 177.19,62.26 178.5,62.26 182.31,58.45 182.31,58.23 185.43,55.1 206.56,55.1 209.34,57.89 209.34,58.51 208.71,59.15 v208.71,61.31
  Bottom 0.152: R14.1 151.45,55.6 166.8,55.6 168.61,57.41 v168.61,61.39 | v208.71,61.31 212.74,65.34 213.9,65.34 217.33,68.77 219.69,68.77 219.87,68.6 221.23,68.6 222.04,69.4 LED2.C
N$61
  Bottom 0.406: Q5.3 Q2.3
N$67  (via drill 0.6)
  Top 0.508: v111.6,67.5 112.69,67.5 113.43,68.24 115.27,68.24 116.01,67.5 v116.4,67.5 117.53,67.5 118.69,68.66 121.69,68.66 121.99,68.96 121.99,70.09 v122.3,70.4
  Bottom 0.508: J3.VBUS v111.6,67.5 | v116.4,67.5 J3.VBUS2 | v122.3,70.4 123.55,70.4 FUSE.1
N$68  (via drill 0.35)
  Top 0.152: 11ENC.S1 7.57,73.5 11.29,69.78 12.79,69.78 14.51,71.5 v18,71.5
  Bottom 0.152: 11.1 15.63,71.5 v18,71.5 17.92,71.42 17.92,61.16 D1.A
N$75  (via drill 0.35)
  Top 0.152: v161.2,41.2 162.38,40.02 173.55,40.02 174.34,39.24 190.92,39.24 191.71,40.02 193.38,40.02 194.54,38.86 202.48,38.86 206.81,34.53 211.38,34.53 214.14,37.28 214.14,38.68 220.83,45.37 220.83,49.45 217.08,53.2 v215,53.2
  Bottom 0.152: R4.2 159.15,41.2 v161.2,41.2 | J1.2 220.27,70.48 223.45,70.48 227.35,66.58 227.35,62.63 227.23,62.51 224.31,62.51 v215,53.2
  Bottom 0.406: Q2.1 158.4,41.95 R4.2
N$76
  Bottom 0.406: Q6.3 140.55,43.1 Q3.1 142.55,42.9 R5.2
N$79
  Bottom 0.152: D79.4 18.91,48.59 22.49,48.59 22.61,48.71 22.61,52.61 26.54,56.54
  Bottom 0.254: D78.2 30.1,60.1 26.54,56.54
N$80
  Bottom 0.203: 22.66,29.68 22.86,29.89 22.86,31.8 23.93,32.87 25.56,32.87 26.19,33.5 26.19,40.81 24.1,42.9 D79.2
  Bottom 0.254: D80.4 20.6,27.63 22.66,29.68
N$81
  Bottom 0.2: D80.2 18.67,21.92 19.73,20.87 21.19,20.87 21.46,21.13 37.56,21.13 38.63,20.06 38.63,10.7 38.76,10.56 41.5,10.56 41.63,10.7 41.63,14.32 48.72,21.41 53.61,21.41 D81.4
N$84  (via drill 0.35)
  Top 0.203: v91,21.45 90.59,21.86 61.56,21.86 v61,21.3
  Bottom 0.2: D81.2 61,18.82 v61,21.3
  Bottom 0.203: v91,21.45 91.85,20.6 D82.4
N$85  (via drill 0.35)
  Top 0.254: v128.15,20.2 128.15,19.98 127,19.98 126.9,20.08 124.97,20.08 123.39,18.49 123.39,16.79 122.03,15.43 110.51,15.43 107.61,12.53 102.83,12.53 101.46,13.89 99,13.89 99,13.95 v97.5,15.45
  Bottom 0.254: D83.4 130.02,20.2 v128.15,20.2 | v97.5,15.45 97.5,17.32 D82.2
N$86  (via drill 0.35)
  Top 0.254: v166.7,19.2 166.65,19.25 v151,19.25
  Bottom 0.254: D83.2 136,17.4 139.45,20.85 149.4,20.85 v151,19.25 | D84.4 167.02,19.2 v166.7,19.2
N$87  (via drill 0.35)
  Top 0.254: v198.25,20.85 196.29,20.85 196.28,20.83 176.13,20.83 v176.1,20.8
  Bottom 0.254: D85.4 200.42,21.92 199.35,20.85 v198.25,20.85 | v176.1,20.8 176.1,19.92 D84.2
N$89
  Bottom 0.254: D85.2 210.6,28.69 209.6,29.68 209.6,32.4 210.71,33.5 213.09,33.5 214.99,35.41 214.99,38.81 215,38.82 215,40.2 212.32,42.88 211.53,42.88 D86.4
N$90
  Bottom 0.254: D86.2 209,48.68 209,56.5 208.6,56.9 D87.4
N$91  (via drill 0.35)
  Top 0.254: v177.5,63 177.1,63.4 144.3,63.4 143.4,62.5 135.5,62.5 133.5,60.5 133.5,58.5 135,57 v137.5,57
  Bottom 0.254: D87.2 180.4,60.1 v177.5,63 | v137.5,57 135.68,57 D88.4
POWER_PIN  (via drill 0.35)
  Top 0.152: U1.29 91.45,45.27 92.57,46.4 92.57,48.23 98.98,54.64 119.57,54.64 124.72,49.5 131.5,49.5 v142,39
  Bottom 0.152: v142,39 R6.1
  Bottom 0.406: R6.1 140.85,40.8 Q6.1
  other vias: 91.45,43.77
RESET  (via drill 0.35)
  Top 0.152: v96.95,42.52 107.48,42.52 109.44,40.55 110.31,40.55 112.06,42.3 v114.37,42.3 117.3,39.37 117.3,38.7 v119,37 | v130.8,41.47 135.46,41.47 139.41,37.52 146.81,37.52 149.07,35.26 156.62,35.26 156.81,35.45 157.19,35.45 157.84,34.8 160.19,34.8 162.64,37.24 166.55,37.24 168.77,39.47 173.32,39.47 174.11,38.68 191.15,38.68 191.94,39.47 193.13,39.47 194.3,38.3 202.25,38.3 206.58,33.97 211.62,33.97 214.7,37.05 214.7,38.44 221.64,45.39 221.64,49.43 219.24,51.83 219.24,51.96 209,62.2 v209,71
  Top 0.254: v88.5,61 86.6,59.1 84.36,59.1 79.27,54 v75.5,54 | v75.98,25 105.8,25 v106.9,26.1
  Bottom 0.152: U1.13 U1.11 U1.9 v96.95,42.52 | R2.2 87.65,65.44 87.77,65.56 87.77,68.9 85.96,70.72 85.96,72.72 86.9,73.66 92.67,73.66 93.48,72.86 93.48,71.9 94.96,70.42 94.96,69.42 95.38,69 98.1,69 98.8,69.7 98.8,71.7 98.24,72.26 J2.3 | v119,37 115.59,33.59 114.49,33.59 114.29,33.79 113.67,33.79 112.34,32.46 112.34,32.04 109.96,29.66 109.1,29.66 108.42,28.98 108.42,27.22 107.3,26.1 v106.9,26.1 | v114.37,42.3 118.27,42.3 120.65,39.92 124.5,39.92 125.17,40.6 128.4,40.6 129.27,41.47 v130.8,41.47 | v209,71 S1.2
  Bottom 0.254: R2.2 87.65,61.85 v88.5,61 | v75.5,54 75.5,25.48 v75.98,25
ROW0  (via drill 0.35)
  Top 0.152: v95.5,44.57 95.5,49.5 v99.5,53.5 | v103,58.5 v122,58.5
  Top 0.254: v19.8,62.8 21,64 v39,64 v55,64 v75.5,64 v95,64 | v175,64 v169,64 156.52,64 156.52,63.99 152.79,63.99 152.78,64 v151.5,64 144.2,64 143.19,62.99 135.44,62.99 130.28,57.83 129.72,57.83 129.06,58.5 v122,58.5 | v181,64 v190,64 196.2,57.8 208.2,57.8 v208.6,58.2
  Bottom 0.152: U1.43 | U1.43 v95.5,44.57 | v99.5,53.5 99.5,56.46 D6.C v103,58.5
  Bottom 0.2: D2.C v39,64 | D3.C v55,64 | D4.C v75.5,64
  Bottom 0.254: v19.8,62.8 19.8,60.96 D1.C | D5.C v95,64 96,65 97.75,65 99.98,62.77 99.98,60.06 D6.C | v181,64 v175,64 | v151.5,64 D8.C | v122,58.5 D7.C | D9.C v169,64 | D10.C v190,64 | D11.C 208.64,58.24 v208.6,58.2 209.76,58.2 D12.C
ROW1  (via drill 0.35)
  Top 0.152: v96.15,44.55 96.34,44.74 96.61,45.02 97,45.02 97.18,44.83 97.94,44.83 98.16,44.61 110.82,44.61 111.72,45.52 114.58,45.52 115.21,44.89 115.21,44.28 121.34,38.15 128.93,38.15 v129,38.21
  Top 0.254: v9.5,37 14,37 16.9,34.1 20.6,34.1 23.5,37 v35,37 v54,37 v64,37 81.5,37 v82.5,36 v111,36 111,35.3 113.8,32.5 117.6,32.5 122.1,37 v129,37 133.5,37 134.6,35.9 v138,35.9 138.4,35.5 146,35.5 148.5,33 160.84,33 163.34,35.5 167.5,35.5 v169,37 v178,37 v197,37 201.9,37 206.1,32.8 212.1,32.8 216,36.7 v216,36.9
  Bottom 0.152: U1.45 v96.15,44.55 | v129,38.21 v129,37
  Bottom 0.254: D13.C v9.5,37 | v82.5,36 81.54,36.96 D17.C | D16.C v64,37 | D15.C v54,37 | D14.C v35,37 | v216,36.9 D24.C | v169,37 D21.C | D22.C v178,37 | D23.C v197,37 | v138,35.9 138,36.96 D20.C | v111,36 110.6,36.4 D18.C | D19.C v129,37
ROW2  (via drill 0.35)
  Top 0.152: v96.8,44.55 97.5,44.55 97.53,44.52 97.86,44.52 98.05,44.33 110.93,44.33 111.84,45.24 114.4,45.24 114.93,44.71 114.93,44.16 121.4,37.7 128.64,37.7 128.69,37.74 132.25,37.74 v132.5,38 | 124,20.88 126.03,22.91 126.03,23.69 132.5,30.16 v132.5,36
  Top 0.254: v9.5,23 v28.5,23 v45,23 46.3,24.3 64.2,24.3 v65.5,23 65.7,23.2 v83.1,23.2 104.15,23.2 v104.35,23 105.52,23 109.64,18.88 109.64,17.9 110.66,16.88 116.84,16.88 118.36,18.4 118.36,18.88 119.94,20.46 122.42,20.46 122.84,20.88 124,20.88 124.78,20.88 129.5,25.6 v134.45,25.6 140.7,25.6 v140.75,25.55 157.95,25.55 v160.5,23 168,23 168.9,23.9 181.6,23.9 v182.5,23 v197,23 213.5,23 214.5,24 v214.5,24.5
  Bottom 0.152: D25.C v9.5,23 | D30.C 103.5,23.85 v104.35,23 | D26.C v28.5,23 | D27.C v45,23 | D28.C v65.5,23 | v83.1,23.2 81.24,23.2 D29.C | U1.47 v96.8,44.55 | v132.5,38 v132.5,36
  Bottom 0.254: v214.5,24.5 214.5,24.04 D36.C | D35.C v197,23 | D34.C v182.5,23 | D33.C v160.5,23 | D32.C 140.65,25.65 v140.75,25.55 | v134.45,25.6 134.4,25.65 D31.C
ROW3  (via drill 0.35, 0.55)
  Top 0.152: U1.3 97.75,43.58 107.61,43.58 108.84,42.34 109.94,42.34 110.42,41.86 110.8,41.86 111.08,42.13 111.08,42.28 112.6,43.8 114.05,43.8 120.35,37.5 120.35,36.6 119.01,35.27 118.91,35.27 116.69,33.05 v113.98,33.05 | v104.75,22.05 103.05,22.05 101.5,20.5
  Top 0.254: v27,20.5 v37.5,20.5 v48.5,20.5 v66.5,20.5 v91.05,20.5 101.5,20.5 107.48,20.5 109.26,18.72 109.26,17.74 110.5,16.5 117,16.5 118.74,18.24 118.74,18.72 120.1,20.08 122.03,20.08 122.05,20.05 122.55,20.05 123,20.5 125.35,20.5 128.7,23.85 v134.35,23.85 v140.7,23.85 146.9,23.85 150.25,20.5 v165.5,20.5 167.1,20.5 169.3,22.7 173,22.7 175.45,20.25 179.85,20.25 v179.9,20.3 206.3,20.3 v206.5,20.5 v212,20.5
  Bottom 0.152: D37.C v27,20.5 | v91.05,20.5 D41.C | D40.C 69.67,20.5 69.06,21.11 67.11,21.11 v66.5,20.5 | D38.C 33.91,20.5 34.51,19.9 36.33,19.9 36.94,20.5 v37.5,20.5 | D42.C 104.65,21.95 v104.75,22.05 104.76,22.05 110.74,28.02 110.74,29.44 112.9,31.6 112.9,31.7 113.98,32.78 v113.98,33.05 | D39.C 51.87,20.5 51.26,21.11 49.66,21.11 49.05,20.5 v48.5,20.5
  Bottom 0.254: v212,20.5 D47.C | D46.C v206.5,20.5 | D45.C 183.94,20.5 183.28,21.16 181.64,21.16 180.78,20.3 v179.9,20.3 | D44.C v165.5,20.5 | 132.7,23.7 D48.C 133.04,23.85 v134.35,23.85 | D43.C 140.65,23.8 v140.7,23.85
  other vias: 97.55,43.77
SCK  (via drill 0.35)
  Top 0.152: v88.46,43.54 88.46,50.45 89.84,51.83 89.84,53.33 86.58,56.59 v86.58,58.08
  Bottom 0.152: U1.30 90.55,43.85 89.04,43.85 88.72,43.54 v88.46,43.54 | v86.58,58.08 83.23,61.43 83.23,67.53 85.68,69.98 85.68,72.83 86.79,73.94 92.79,73.94 94.47,72.26 J2.4
SWD  (via drill 0.35)
  Top 0.152: v85,57.5 86.24,56.26 86.24,51.83 87.99,50.08 87.99,43.35 88.27,43.08 88.65,43.08 88.73,43.15 v88.99,43.15
  Bottom 0.152: U1.28 89.29,43.45 v88.99,43.15 | v85,57.5 82.23,60.27 82.23,61.09 82.95,61.81 82.95,67.64 85.4,70.09 85.4,72.95 86.67,74.22 92.91,74.22 93.6,73.53 J2.2
V_BATT  (via drill 0.35, 0.55)
  Top 0.152: v168.14,58.8 169.4,60.06 169.4,61.79 170.12,62.51 176.54,62.51 177.08,61.98 178.16,61.98 185.31,54.83 206.67,54.83 209.62,57.78 209.62,58.22 v210.6,59.2
  Top 0.508: v151.5,53 151.5,39 151.88,39 152.17,38.71 152.83,38.71 153.12,39 v155,39 | v166.4,57.2 v166.4,55.1
  Bottom 0.152: X1.2 167.64,59.3 v168.14,58.8 | v210.6,59.2 210.97,59.57 210.97,62.75 211.82,63.6 218.81,63.6 223.45,68.24 223.45,70.08 223.33,70.2 217.55,70.2 J1.1
  Bottom 0.508: J4.1 144.65,56.9 R15.2 146.48,55.07 148.19,55.07 | IC2.3 148.65,59.25 148.19,58.79 148.19,55.07 | 151.69,54.47 148.19,54.47 148.19,55.07 | 151.69,54.47 152,54.47 152.6,55.07 158.78,55.07 158.81,55.04 166.34,55.04 v166.4,55.1 | 151.69,54.47 151.69,53.19 v151.5,53 | Q2.2 156.05,40.05 v155,39 155.6,38.4 R19.1 | X1.2 166.6,57.4 v166.4,57.2
V_RAW
  Bottom 0.406: Q3.2 144.35,41.2 R5.1 146.66,43 D63.1 149.69,42.66 Q5.2 150.4,42.27 VREG.3 | C6.1 153.9,43.55 VREG.3 | VREG.1 151.37,45.13 150.9,45.13 150.68,44.91 150.68,44.09 151.22,43.55 VREG.3
V_USB  (via drill 0.35, 0.55)
  Top 0.152: U1.12 95.29,42.21 95.29,42.54 94.67,43.17 92.81,43.17 91.85,44.13 91.85,44.97 92.45,45.58 92.68,45.58 93.5,46.4 v93.5,48 | v160.6,62.16 160.79,62.34 166.3,62.34 167.41,61.23 167.79,61.23 169.63,63.07 176.77,63.07 177.31,62.53 178.62,62.53 182.58,58.57 182.58,58.34 185.54,55.38 206.44,55.38 209.07,58.01 209.07,58.39 208.2,59.26 v208.2,61.8
  Top 0.203: v96.9,64 96.9,66.5 99.4,69 107.6,69
  Top 0.254: v126.5,70.5 126.23,70.5 124.21,72.52 122.29,72.52 121.48,71.71 121.48,69.17 117.88,69.17 117.58,69.47 110.42,69.47 110.12,69.17 107.77,69.17 107.6,69 | v152.5,39.5 152.9,39.5 153.07,39.67 155.28,39.67 155.67,39.28 155.67,39.03 v157.6,37.1
  Top 0.508: v152.5,39.5 152.5,54.5 155.5,57.5 v155.5,59.2
  Bottom 0.152: 159.15,62.5 159.49,62.16 v160.6,62.16 | v208.2,61.8 212.26,65.86 212.26,66.98 214.69,69.4 LED2.A
  Bottom 0.203: v93.5,48 93.5,60.6 v96.9,64
  Bottom 0.406: D63.2 150.11,40.34 Q5.1
  Bottom 0.508: IC2.4 153.5,59.25 C4.1 154.85,59.2 v155.5,59.2 156.57,60.27 | R17.2 159.15,62.5 159.15,59.24 158.57,58.66 158.03,58.66 157.43,59.26 157.43,59.42 156.57,60.27 | 126.39,71.54 D67.A 142.2,71.54 146.25,67.49 146.25,64.05 147.08,63.21 150.53,63.21 150.94,62.8 155.18,62.8 156.57,61.4 156.57,60.27 | Q5.1 150.95,39.5 v152.5,39.5 | FUSE.2 126.39,71.54 | 126.39,71.54 126.39,70.61 v126.5,70.5
  other vias: 95.8,41.7
V_WS2812  (via drill 0.55)
  Top 0.508: v37.5,57 42.04,61.54 62.67,61.54 63.71,60.5 74,60.5 74.25,60.25 | 74.25,60.25 v76,58.5 | 74.25,60.25 77,63 100.74,63 101.14,63.4 106.07,63.4 107.49,61.98 118.72,61.98 120.14,63.4 125.07,63.4 126.49,61.98 126.52,61.98 v130,58.5 135,63.5 142.97,63.5 144.95,65.48 144.95,66.95 146.5,68.5 149,68.5 153,64.5 156.31,64.5 159.05,67.24 159.05,67.52 160.49,68.95 162.45,68.95 162.5,69 171.03,69 174.87,65.17 176.63,65.17 v183.2,58.6 185.8,56 v198,56 | v151.35,21.6 167.38,21.6 169.09,23.31 173.29,23.31 175.1,21.5 176.6,21.5 | 176.6,21.5 v196,21.5 | v132,57 136.98,52.02 139.51,52.02 140.67,50.86 140.67,49.22 140.05,48.6 140.05,46.48 145,41.53 v145,39.5 | v96.3,21.75 95.71,22.34 65.3,22.34 65.28,22.36 65.23,22.36 64.7,22.89 v57.3,22.89 47.48,22.89 46.09,21.5 20,21.5 v19.5,22 | 176.6,21.5 v175.85,22.25
  Bottom 0.508: v37.5,57 37.4,56.9 D78.1 33.08,54.56 30.22,54.56 26.67,51.01 26.67,49.22 24.75,47.3 24.75,46.95 23.91,46.1 | v76,58.5 74.4,56.9 D77.1 | v130,58.5 130.42,58.08 D88.1 131.9,56.9 v132,57 | v198,56 205.19,56 207.21,53.99 207.21,51.17 205.33,49.3 204.2,49.3 204.2,49.01 203.25,48.05 203.25,46.08 D86.1 209.71,42.9 210.59,42.02 212.17,42.02 214.49,39.7 214.49,39.03 214.49,39.02 214.49,35.62 212.88,34.01 210.5,34.01 209.09,32.61 209.09,28.77 D85.1 202.75,22.43 200.21,22.43 199.29,21.51 v196.01,21.51 v196,21.5 | D87.1 183.2,58.32 v183.2,58.6 | D83.1 136.58,21.6 v151.35,21.6 | Q3.3 144.1,39.5 v145,39.5 | D82.1 97.45,20.6 v96.3,21.75 | v19.5,22 20.52,22 D80.1 20.6,23.79 24.75,27.95 24.75,28.3 26.67,30.22 26.67,43.34 23.91,46.1 | 23.91,46.1 D79.1 | D81.1 57.3,22.88 v57.3,22.89 | v175.85,22.25 175.23,22.25 D84.1
VDD_NRF  (via drill 0.35)
  Top 0.152: v89,42.5 91,44.5 91,45.5 91.96,46.46 91.96,48.01 98.95,55 119.61,55 124.83,49.78 131.62,49.78 135.4,46 139.43,46 v140.33,45.1
  Top 0.254: v89,42.5 89.14,42.64 89.21,42.64 89.51,42.94 89.51,43.37 88.79,44.09 88.79,50.31 90.17,51.7 90.17,53.46 89.5,54.14 v89.5,60.5
  Bottom 0.152: U1.26 89.3,42.8 v89,42.5 | R2.1 89.35,67.72 86.24,70.83 86.24,72.6 86.51,72.6 87.29,73.38 92.56,73.38 93.2,72.74 93.2,71.7 94.68,70.22 94.68,69.3 95.27,68.72 98.21,68.72 99.08,69.58 99.08,71.82 98.71,72.18 98.71,72.42 97.6,73.53 J2.1
  Bottom 0.254: v89.5,60.5 89.35,60.65 R2.1
  Bottom 0.406: D66.A 139.17,43.71 139.17,43.94 v140.33,45.1 143.49,45.1 143.84,45.45 VREG.5
WS2812  (via drill 0.35)
  Top 0.152: v94.82,42.35 94.5,42.67 91.67,42.67 90.6,41.6 82.9,41.6 v81.5,43
  Bottom 0.152: U1.15 v94.82,42.35 | D77.4 90.04,56.9 93.03,53.91 93.03,51.25 91.28,49.49 89.75,49.49 88.59,48.33 88.59,47.06 84.52,43 v81.5,43

## Text on the board
bPlace: + - | + -
200bmp: C:/Users/harry/Downloads/alu40 logo black.bmp
226bmp: C:/Users/harry/Downloads/alu40 logo black.bmp | C:/Users/harry/Downloads/huiben lab icon black.bmp